# Altium schematic sheet Hard_Node.SchDoc
size A2
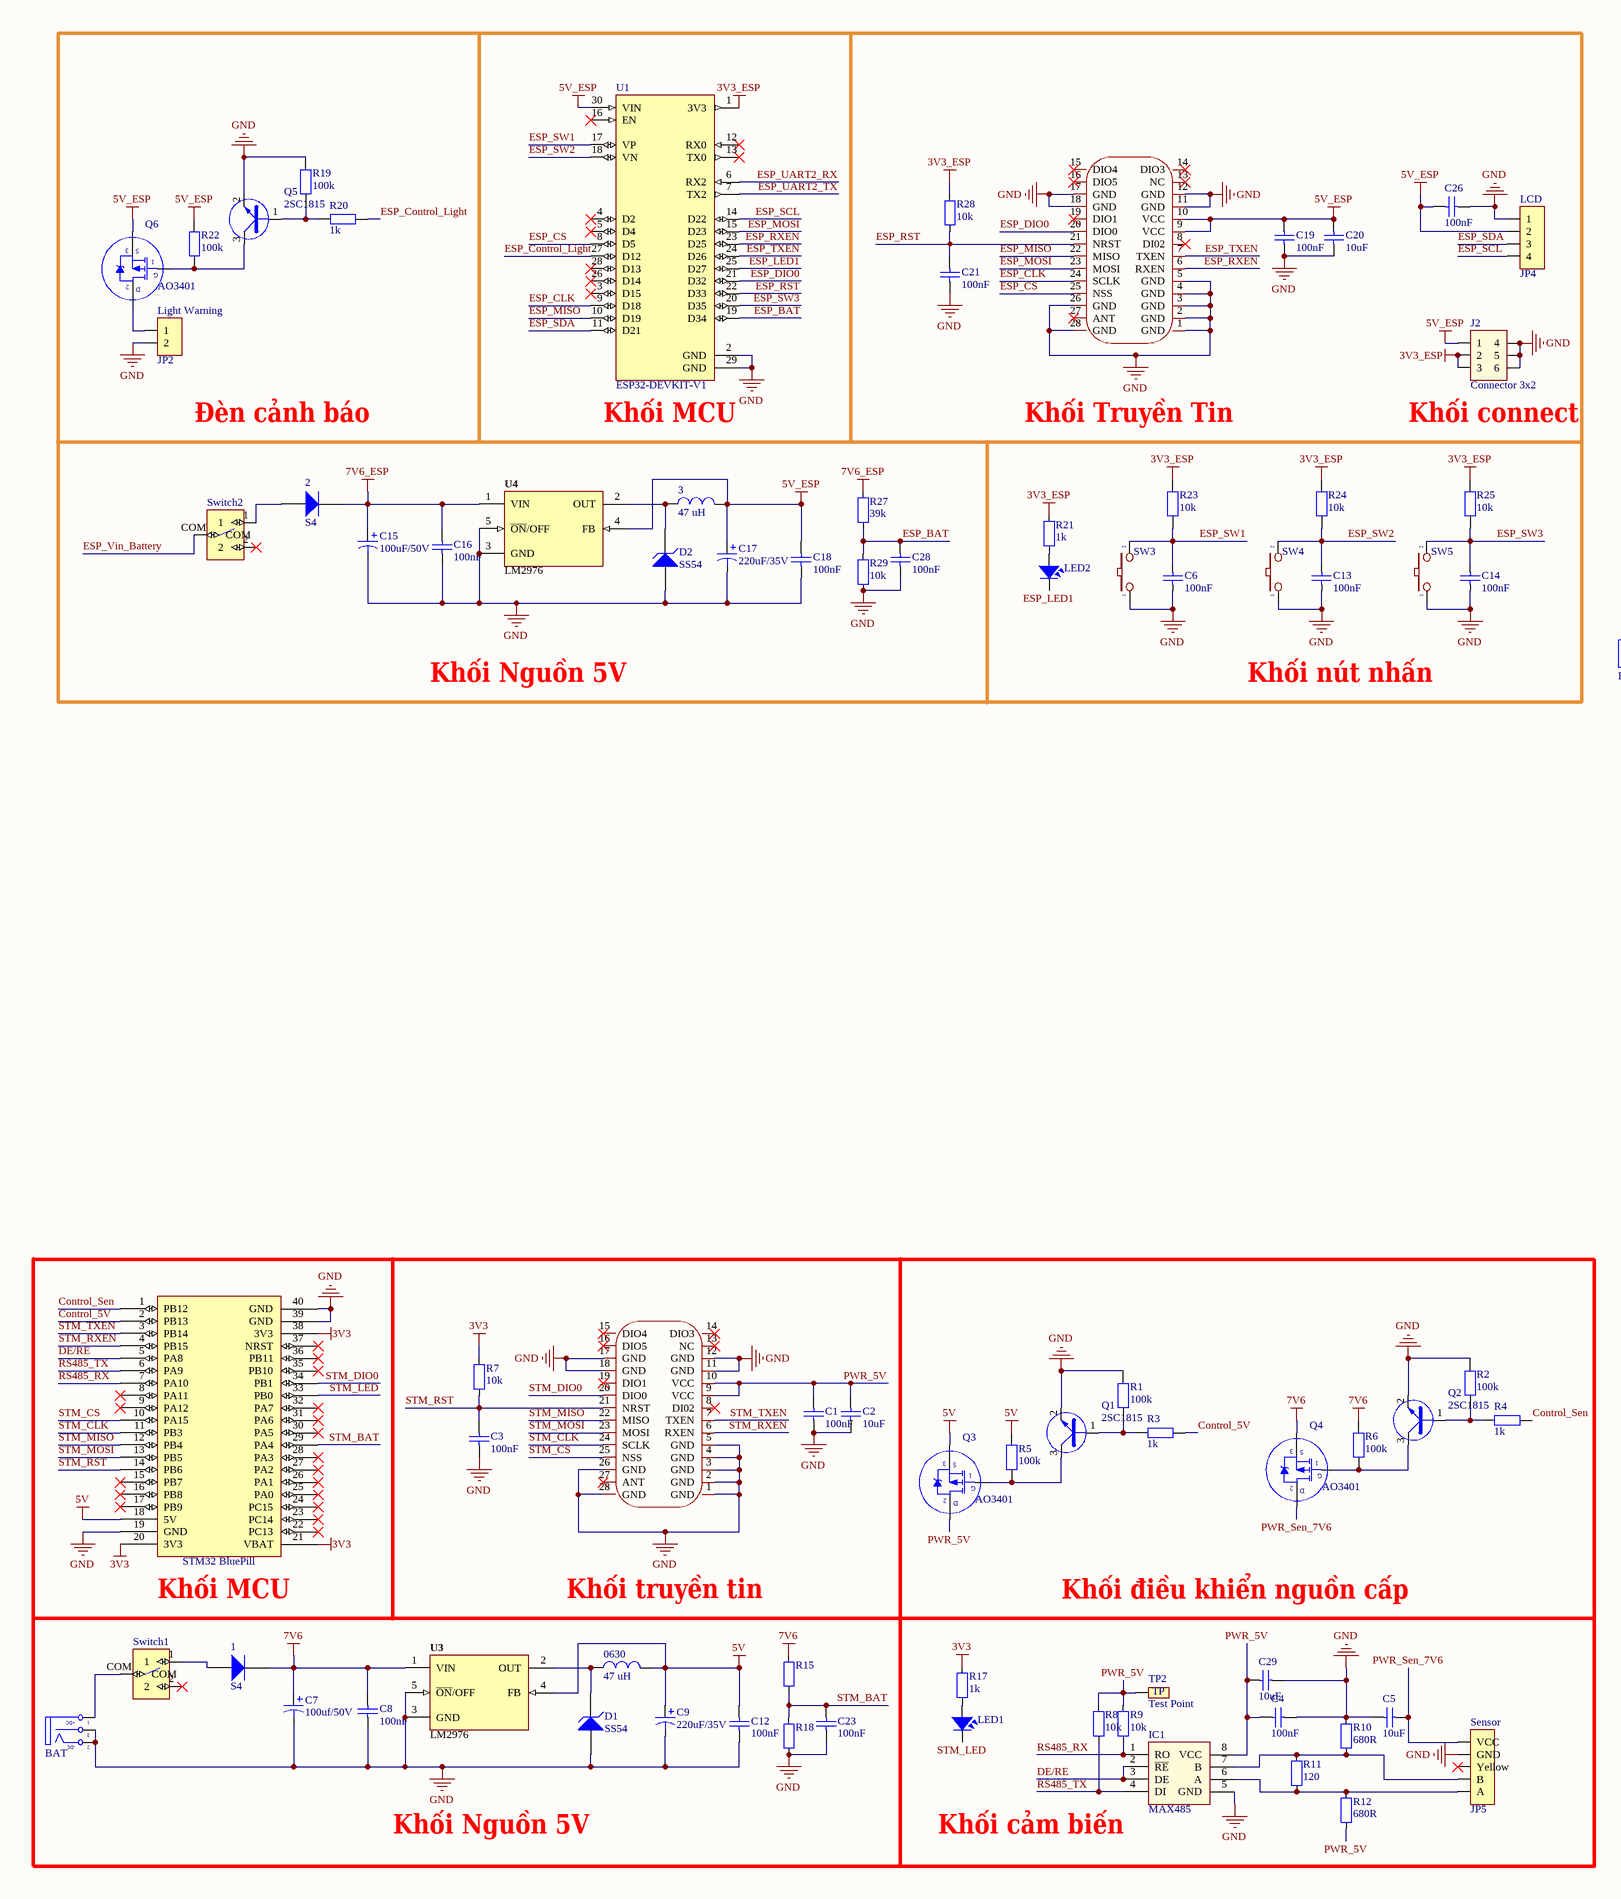
[diagram p0: Hard_Node.SchDoc, left]
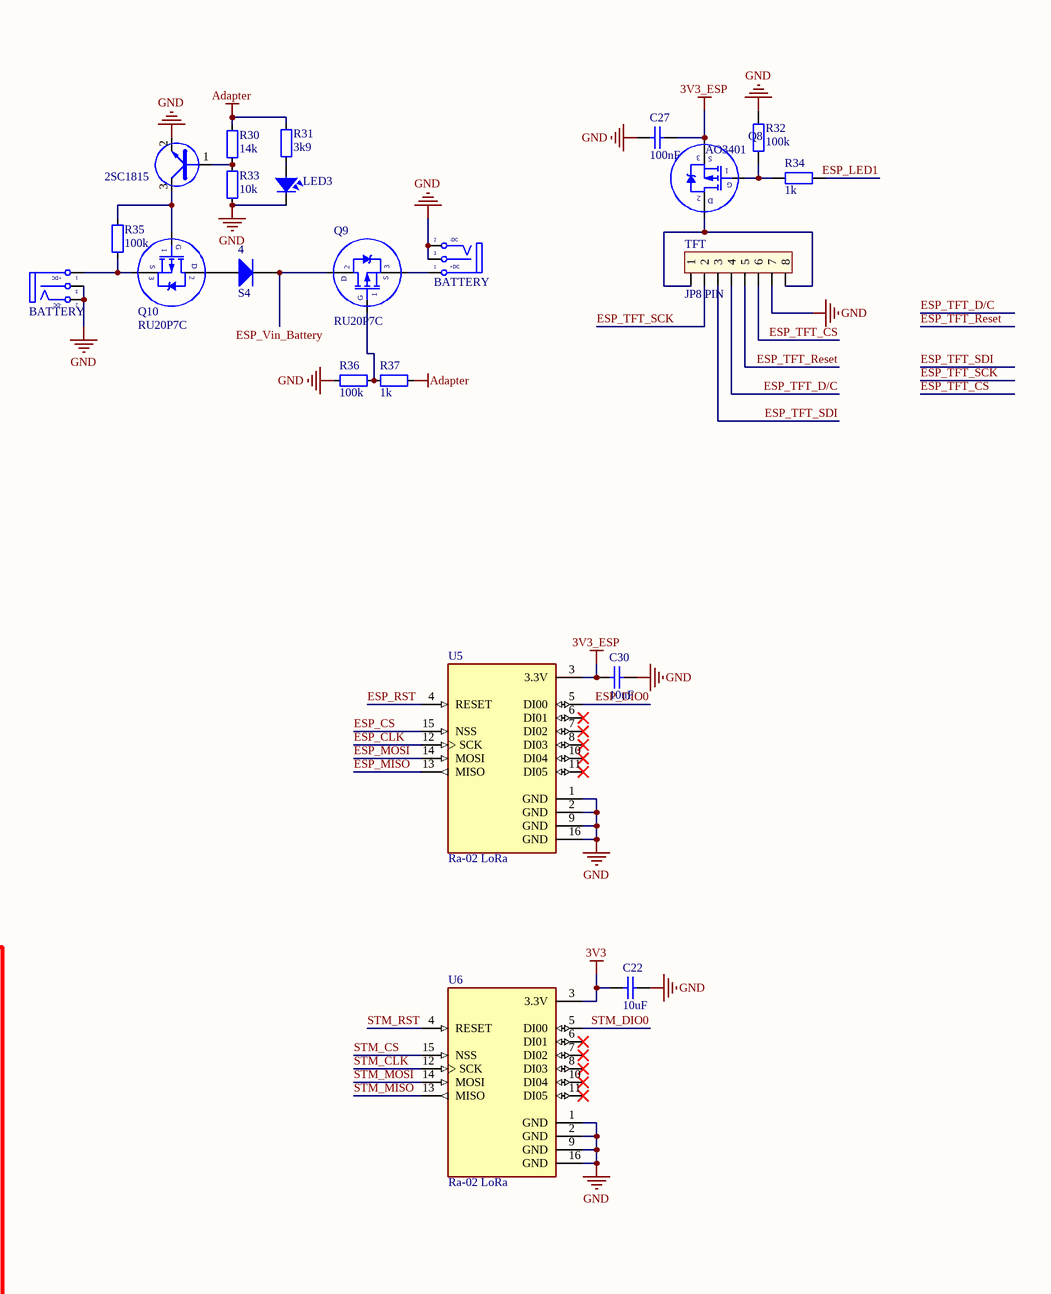
[diagram p1: Hard_Node.SchDoc, right]

## Parts
1  S4  [DIO-214AC(SMA)]
2  S4  [DIO-214AC(SMA)]
3  47 uH  [inductor-7mm]
4  S4  [DIO-214AC(SMA)]
0630  47 uH  [inductor-7mm]
C1  100nF  [CAP_0805]
C2  10uF  [CAP_0805]
C3  100nF  [CAP_0805]
C4  100nF  [CAP_0805]
C5  10uF  [CAP_0805]
C6  100nF  [CAP_0805]
C7  100uf/50V  [CAP-ALU-SMD-8.3]
C8  100nF  [CAP_0805]
C9  220uF/35V  [CAP-ALU-SMD-8.3]
C12  100nF  [CAP_0805]
C13  100nF  [CAP_0805]
C14  100nF  [CAP_0805]
C15  100uF/50V  [CAP-ALU-SMD-8.3]
C16  100nF  [CAP_0805]
C17  220uF/35V  [CAP-ALU-SMD-8.3]
C18  100nF  [CAP_0805]
C19  100nF  [CAP_0805]
C20  10uF  [CAP_0805]
C21  100nF  [CAP_0805]
C22  10uF  [CAP_0805]
C23  100nF  [CAP_0805]
C26  100nF  [CAP_0805]
C27  100nF  [CAP_0402]
C28  100nF  [CAP_0805]
C29  10uF  [CAP_0805]
C30  10uF  [CAP_0805]
D1  SS54  [DIO-214AC(SMA)]
D2  SS54  [DIO-214AC(SMA)]
IC1  MAX485  [SO-8]
J2  Connector 3x2  [JP3x2]
JDC1  BAT  [DC-IN]
JDC2  BATTERY  [DC-IN]
JDC?  BATTERY  [DC-IN]
LCD  JP4  [JP4-C1T]
LED1  LED  [LED-0805-Blue]  (value not drawn)
LED2  LED  [LED-0805-Blue]  (value not drawn)
LED3  LED  [LED-0805-Blue]  (value not drawn)
Light_Warning  JP2  [JP2-C1T]
Q1  2SC1815  [SOT23D]
Q2  2SC1815  [SOT23D]
Q3  AO3401  [SOT23A]
Q4  AO3401  [SOT23A]
Q5  2SC1815  [SOT23D]
Q6  AO3401  [SOT23A]
Q7  2SC1815  [SOT23D]
Q8  AO3401  [SOT23A]
Q9  RU20P7C  [SOT23A]
Q10  RU20P7C  [SOT23A]
R1  100k  [RES-SMD-0805]
R2  100k  [RES-SMD-0805]
R3  1k  [RES-SMD-0805]
R4  1k  [RES-SMD-0805]
R5  100k  [RES-SMD-0805]
R6  100k  [RES-SMD-0805]
R7  10k  [RES-SMD-0805]
R8  10k  [RES-SMD-0805]
R9  10k  [RES-SMD-0805]
R10  680R  [RES-SMD-0805]
R11  120  [RES-SMD-0805]
R12  680R  [RES-SMD-0805]
R15  39k  [RES-SMD-0805]  (value not drawn)
R17  1k  [RES-SMD-0805]
R18  11k  [RES-SMD-0805]  (value not drawn)
R19  100k  [RES-SMD-0805]
R20  1k  [RES-SMD-0805]
R21  1k  [RES-SMD-0805]
R22  100k  [RES-SMD-0805]
R23  10k  [RES_SMD_0805]
R24  10k  [RES_SMD_0805]
R25  10k  [RES_SMD_0805]
R27  39k  [RES-SMD-0805]
R28  10k  [RES-SMD-0805]
R29  10k  [RES-SMD-0805]
R30  14k  [RES-SMD-0805]
R31  3k9  [RES-SMD-0805]
R32  100k  [RES-SMD-0805]
R33  10k  [RES-SMD-0805]
R34  1k  [RES-SMD-0805]
R35  100k  [RES-SMD-0805]
R36  100k  [RES-SMD-0805]
R37  1k  [RES-SMD-0805]
Sensor  JP5  [KF5-5]
SW3  SW  [SW2]  (value not drawn)
SW4  SW  [SW2]  (value not drawn)
SW5  SW  [SW2]  (value not drawn)
Switch1  SK12D07VG4  [SS12D01]  (value not drawn)
Switch2  SK12D07VG4  [SK12D07VG4]  (value not drawn)
SX1  E32-400M30S  [E32-400M30S]  (value not drawn)
SX1278  E32-400M30S  [E32-400M30S]  (value not drawn)
TFT  JP8 PIN  [JP8]
TP2  Test Point  [TP_SMD]
U1  ESP32-DEVKIT-V1  [MODULE_ESP32_DEVKIT_V1]
U2  STM32 BluePill  [STM32 Bluepill]
U3  LM2976  [TO-263]
U4  LM2976  [TO-263]
U5  Ra-02 LoRa  [Ra-02]
U6  Ra-02 LoRa  [Ra-02]

## Nets
3V3: C22.1 R7.1 R17.1 U2.20(3V3) U2.21(VBAT) U2.38(3V3) U6.3(3.3V)
3V3_ESP: C27.2 C30.1 J2.2 J2.3 Q8.3(S) R21.1 R23.1 R24.1 R25.1 R28.1 U1.1(3V3) U5.3(3.3V)
5V: 0630.2 C9.1 C12.1 Q3.3(S) R5.1 U2.18(5V) U3.4(FB)
5V_ESP: 3.2 C17.1 C18.1 C19.2 C20.2 C26.1 J2.1 LCD.2 Q6.3(S) R22.1 SX1.9(VCC) SX1.10(VCC) U1.30(VIN) U4.4(FB)
7V6: 1.2(K) C7.1 C8.1 Q4.3(S) R6.1 R15.1 U3.1(VIN)
7V6_ESP: 2.2(K) C15.1 C16.1 R27.1 U4.1(VIN)
Adapter: R30.1 R31.1 R37.1
GND: C1.1 C2.1 C3.1 C4.2 C5.1 C6.2 C7.2 C8.2 C9.2 C12.2 C13.2 C14.2 C15.2 C16.2 C17.2 C18.2 C19.1 C20.1 C21.1 C22.2 C23.2 C26.2 C27.1 C28.2 C29.2 C30.2 D1.1(A) D2.1(A) IC1.5(GND) J2.4 J2.5 J2.6 JDC1.2(TN) JDC1.3(S) JDC2.2(TN) JDC2.3(S) JDC?.2(TN) JDC?.3(S) LCD.1 LED3.2 Light_Warning.2 Q1.2(E) Q2.2(E) Q5.2(E) Q7.2(E) R1.2 R2.2 R10.1 R18.2 R19.2 R29.2 R32.2 R33.2 R36.2 Sensor.2(GND) SW3.1 SW4.1 SW5.1 SX1.1(GND) SX1.2(GND) SX1.3(GND) SX1.4(GND) SX1.5(GND) SX1.11(GND) SX1.12(GND) SX1.17(GND) SX1.18(GND) SX1.26(GND) SX1.28(GND) SX1278.1(GND) SX1278.2(GND) SX1278.3(GND) SX1278.4(GND) SX1278.5(GND) SX1278.11(GND) SX1278.12(GND) SX1278.17(GND) SX1278.18(GND) SX1278.26(GND) SX1278.28(GND) TFT.7 U1.2(GND) U1.29(GND) U2.19(GND) U2.39(GND) U2.40(GND) U3.3(GND) U3.5(~{ON}/OFF) U4.3(GND) U4.5(~{ON}/OFF) U5.1(GND) U5.2(GND) U5.9(GND) U5.16(GND) U6.1(GND) U6.2(GND) U6.9(GND) U6.16(GND)
Control_5V: R3.2 U2.2(PB13)
Control_Sen: R4.2 U2.1(PB12)
DE/RE: IC1.2(~{RE}) IC1.3(DE) U2.5(PA8)
ESP_BAT: C28.1 R27.2 R29.1 U1.19(D34)
ESP_CLK: SX1.24(SCLK) U1.9(D18) U5.12(SCK)
ESP_Control_Light: R20.2 U1.27(D12)
ESP_CS: SX1.25(NSS) U1.8(D5) U5.15(NSS)
ESP_DIO0: SX1.20(DIO0) U1.21(D32) U5.5(DI00)
ESP_LED1: LED2.2 R34.2 U1.25(D27)
ESP_MISO: SX1.22(MISO) U1.10(D19) U5.13(MISO)
ESP_MOSI: SX1.23(MOSI) U1.15(D23) U5.14(MOSI)
ESP_RST: C21.2 R28.2 SX1.21(NRST) U1.22(D33) U5.4(RESET)
ESP_RXEN: SX1.6(RXEN) U1.23(D25)
ESP_SCL: LCD.4 U1.14(D22)
ESP_SDA: LCD.3 U1.11(D21)
ESP_SW1: C6.1 R23.2 SW3.2 U1.17(VP)
ESP_SW2: C13.1 R24.2 SW4.2 U1.18(VN)
ESP_SW3: C14.1 R25.2 SW5.2 U1.20(D35)
ESP_TFT_CS: TFT.6
ESP_TFT_D/C: TFT.4
ESP_TFT_Reset: TFT.5
ESP_TFT_SCK: TFT.2
ESP_TFT_SDI: TFT.3
ESP_TXEN: SX1.7(TXEN) U1.24(D26)
ESP_UART2_RX: U1.6(RX2)
ESP_UART2_TX: U1.7(TX2)
ESP_Vin_Battery: 4.2(K) Q9.2(D) Switch2.COM
PWR_5V: C1.2 C2.2 C4.1 C29.1 IC1.8(VCC) Q3.2(D) R8.1 R9.1 R12.2 SX1278.9(VCC) SX1278.10(VCC) TP2.1
PWR_Sen_7V6: C5.2 Q4.2(D) Sensor.1(VCC)
RS485_RX: IC1.1(RO) R9.2 U2.7(PA10)
RS485_TX: IC1.4(DI) R8.2 U2.6(PA9)
STM_BAT: C23.1 R15.2 R18.1 U2.29(PA4)
STM_CLK: SX1278.24(SCLK) U2.11(PB3) U6.12(SCK)
STM_CS: SX1278.25(NSS) U2.10(PA15) U6.15(NSS)
STM_DIO0: SX1278.20(DIO0) U2.34(PB1) U6.5(DI00)
STM_LED: LED1.2 U2.33(PB0)
STM_MISO: SX1278.22(MISO) U2.12(PB4) U6.13(MISO)
STM_MOSI: SX1278.23(MOSI) U2.13(PB5) U6.14(MOSI)
STM_RST: C3.2 R7.2 SX1278.21(NRST) U2.14(PB6) U6.4(RESET)
STM_RXEN: SX1278.6(RXEN) U2.4(PB15)
STM_TXEN: SX1278.7(TXEN) U2.3(PB14)
Net1_1: 1.1(A) Switch1.1
Net2_1: 2.1(A) Switch2.1
Net3_1: 3.1 D2.2(K) U4.2(OUT)
Net4_1: 4.1(A) Q10.2(D)
Net0630_1: 0630.1 D1.2(K) U3.2(OUT)
NetIC1_6: IC1.6(A) R11.2 R12.1 Sensor.5(A)
NetIC1_7: IC1.7(B) R10.2 R11.1 Sensor.4(B)
NetJDC1_1: JDC1.1(T) Switch1.COM
NetJDC2_1: JDC2.1(T) Q9.3(S)
NetJDC?_1: JDC?.1(T) Q10.3(S) R35.1
NetLED1_1: LED1.1 R17.2
NetLED2_1: LED2.1 R21.2
NetLED3_1: LED3.1 R31.2
NetLight_Warning_1: Light_Warning.1 Q6.2(D)
NetQ1_1: Q1.1(B) R1.1 R3.1
NetQ1_3: Q1.3(C) Q3.1(G) R5.2
NetQ2_1: Q2.1(B) R2.1 R4.1
NetQ2_3: Q2.3(C) Q4.1(G) R6.2
NetQ5_1: Q5.1(B) R19.1 R20.1
NetQ5_3: Q5.3(C) Q6.1(G) R22.2
NetQ7_1: Q7.1(B) R30.2 R33.1
NetQ7_3: Q7.3(C) Q10.1(G) R35.2
NetQ8_1: Q8.1(G) R32.1 R34.1
NetQ8_2: Q8.2(D) TFT.1 TFT.8
NetQ9_1: Q9.1(G) R36.1 R37.2

Not connected (* = marked no-connect by the designer): Sensor 3(Yellow)*; Switch1 2*; Switch2 2*; SX1 8(DI02)* 13(NC)* 14(DIO3)* 15(DIO4)* 16(DIO5)* 19(DIO1)* 27(ANT)*; SX1278 8(DI02)* 13(NC)* 14(DIO3)* 15(DIO4)* 16(DIO5)* 19(DIO1)* 27(ANT)*; U1 3(D15)* 4(D2)* 5(D4)* 12(RX0)* 13(TX0)* 16(EN)* 26(D14)* 28(D13)*; U2 8(PA11)* 9(PA12)* 15(PB7)* 16(PB8)* 17(PB9)* 22(PC13)* 23(PC14)* 24(PC15)* 25(PA0)* 26(PA1)* 27(PA2)* 28(PA3)* 30(PA5)* 31(PA6)* 32(PA7)* 35(PB10)* 36(PB11)* 37(NRST)*; U5 6(DI01)* 7(DI02)* 8(DI03)* 10(DI04)* 11(DI05)*; U6 6(DI01)* 7(DI02)* 8(DI03)* 10(DI04)* 11(DI05)*

## Notes on the sheet
- Đèn cảnh báo
- (near U1) Khối MCU
- Khối Truyền Tin
- (near J2) Khối connect
- Khối Nguồn 5V
- Khối nút nhấn
- (near U2) Khối MCU
- Khối truyền tin
- Khối điều khiển nguồn cấp
- (near IC1) Khối cảm biến
- (in symbol DCIN) +DC; -DC

## Library data of the parts
1 2 4 = Diode S4: Dán; Ten_Linh_Kien: Diode S4 SOD123 ( 1N5819 SOD123); Ma_Hang: MH005519; Don_Vi: Con; Ghi_Chu: *; Chung_Loai: Dán; Kieu_Chan: *
3 0630 = Inductor: Value: 150 mH
C1-C6 C8 C12-C14 C16 C18-C23 C26-C30 = CapSMD: Capacitor; Value: 33p; Published: 8-Jun-2000; LatestRevisionDate: 17-Jul-2002; LatestRevisionNote: Re-released for DXP Platform.; PackageReference: RAD-0.3; Publisher: Altium Limited
C7 C9 C15 C17 = Cap Pol: Polarized Capacitor (Axial); Published: 8-Jun-2000; LatestRevisionDate: 17-Jul-2002; LatestRevisionNote: Re-released for DXP Platform.; PackageReference: POLAR0.8; Publisher: Altium Limited
D1 D2 = Diode Zener: SS34; Published: 8-Jun-2000; LatestRevisionDate: 17-Jul-2002; LatestRevisionNote: Re-released for DXP Platform.; PackageReference: DIODE-0.7; Publisher: Altium Limited
IC1 = MAX485: RS232 - RS485 (Same sn75176)
J2 = JP3x2: Value: Connector 3x2
JDC1 JDC2 JDC? = DCIN: Jac DC input; Value: Jac DC
LCD = JP4: WR-PHD 2.54 mm Angled Socket Header; Manufacturer: W¨¹rth Elektronik eiSos GmbH; partNo: 613004143121; ComponentLink1 Description: Manufacturer; ComponentLink2 Description: Datasheet; NoPins: 04; Created Date: 29 March 2013; ComponentLink1URL: http://www.we-online.com; ComponentLink2URL: http://katalog.we-online.de/em/datasheet/6130xx143121.pdf; Created by: Karrer Zheng
LED1-LED3 = LED: LED Single colour Green and Red; Value: LED 3 ly Single Colour
Light_Warning = JP2: WR-PHD 2.54 mm Angled Socket Header; Manufacturer: W¨¹rth Elektronik eiSos GmbH; partNo: 613002143121; ComponentLink1 Description: Manufacturer; ComponentLink2 Description: Datasheet; NoPins: 02; Created Date: 29 March 2013; ComponentLink1URL: http://www.we-online.com; ComponentLink2URL: http://katalog.we-online.de/em/datasheet/6130xx143121.pdf; Created by: Karrer Zheng
Q1 Q2 Q5 Q7 = C1815: NPN 600mW, ECB; Value: C1815
Q3 Q4 Q6 Q8-Q10 = MOSFET_P: 30V 5.8A P-Channel MOSFET
R1-R6 R19 R20 R22-R25 R32 R34 = Resistor - SMD: Resistor SMD; Manufacturer: Generic Components; Class: Passive; Published: 08/06/2000; Publisher: Altium Hobart Technology Centre
R7-R12 R15 R17 R18 R21 R27-R31 R33 R35-R37 = Resistor - SMD: Resistor; Manufacturer: Generic Components; Class: Passive; Published: 08/06/2000; Publisher: Altium Hobart Technology Centre
Sensor = JP5x1: WR-PHD 2.54 mm Angled Socket Header; Manufacturer: W¨¹rth Elektronik eiSos GmbH; partNo: 613005143121; ComponentLink1 Description: Manufacturer; ComponentLink2 Description: Datasheet; NoPins: 05; Created Date: 29 March 2013; ComponentLink1URL: http://www.we-online.com; ComponentLink2URL: http://katalog.we-online.de/em/datasheet/6130xx143121.pdf; Created by: Karrer Zheng
SW3-SW5 = SW2: Switch button 2 pin; Value: SW chip 2 pin
Switch1 Switch2 = SK12D07VG4: Switch Slide ON ON SPDT Side Slide 0.3A 30VDC PC Pins Bracket Mount/Through Hole Bulk; MF: C&K; Price: None; Check_prices: https://www.snapeda.com/parts/SK12D07VG4/C&K/view-part/6618061/?ref=eda; SnapEDA_Link: https://www.snapeda.com/parts/SK12D07VG4/C&K/view-part/6618061/?ref=snap; Package: None; Availability: Not in stock; MP: SK12D07VG4; Value: *
SX1 SX1278 = E32-400M30S: Manufacturer: EBYTE(亿佰特); Add into BOM: yes; Symbol: E32-400M30S; Device: E32-400M30S; LCSC Part Name: 433MHz LORA无线扩频模块SX1276 SX1278远距离低功耗SPI 1W 30dbm; Supplier Part: C2965515; Manufacturer Part: E32-400M30S; Supplier Footprint: SMD,24x38.5mm; JLCPCB Part Class: Extended Part; Datasheet: https://atta.szlcsc.com/upload/public/pdf/source/20220120/94D33D6D180E48FAF7662385DA0CD224.pdf; Supplier: LCSC; Convert to PCB: yes
TFT = JP8: Value: JP7
TP2 = TP: CONNECT 1
U1 = ESP32-DEVKIT-V1: Dual core, Wi-Fi: 2.4 GHz up to 150 Mbits/s,BLE (Bluetooth Low Energy) and legacy Bluetooth, 32 bits, Up to 240 MHz; MF: Do it; Price: None; Availability: Not in stock; Package: None; MP: ESP32-DEVKIT-V1; Value: *; SnapEDA_Link: https://www.snapeda.com/parts/ESP32-DEVKIT-V1/Do+it/view-part/?ref=snap; Check_prices: https://www.snapeda.com/parts/ESP32-DEVKIT-V1/Do+it/view-part/?ref=eda
U2 = STM32 BluePill: STM32F103C8T6 breakout board
U3 U4 = LM2596: Max Input Voltage: 12 V; Max Output Current: 3 (6.0 peak) A; Max Output Voltage: mV; Category: IC-Power; Min Input Voltage: mV; Min Output Voltage: mV; Mounting Technology: Surface Mount; Status: Unreleased; Supply Voltage: mV; Temperature Range: -40 to +125 degC
U5 U6 = Ra-02 LoRa: LoRa Module Ra-02